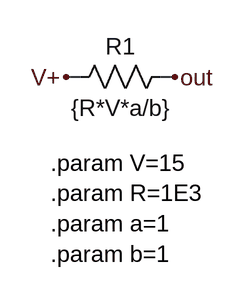
[diagram p0: schematic coefficient.asc]
coefficient.asc, the LTspice schematic file:
Version 4
SHEET 1 880 680
WIRE 208 112 192 112
WIRE 304 112 288 112
FLAG 192 112 V+
FLAG 304 112 out
SYMBOL Res 304 96 R90
WINDOW 0 0 56 VBottom 2
WINDOW 3 32 56 VTop 2
SYMATTR InstName R1
SYMATTR Value {R*V*a/b}
TEXT 176 200 Left 2 !.param V=15\n.param R=1E3\n.param a=1\n.param b=1

The netlist it stands for:
* coefficient.asc
R1 out V+ {R*V*a/b}
.param V=15
.param R=1E3
.param a=1
.param b=1
.backanno
.end